# EAGLE design LM2675_imp (EAGLE 6.4)
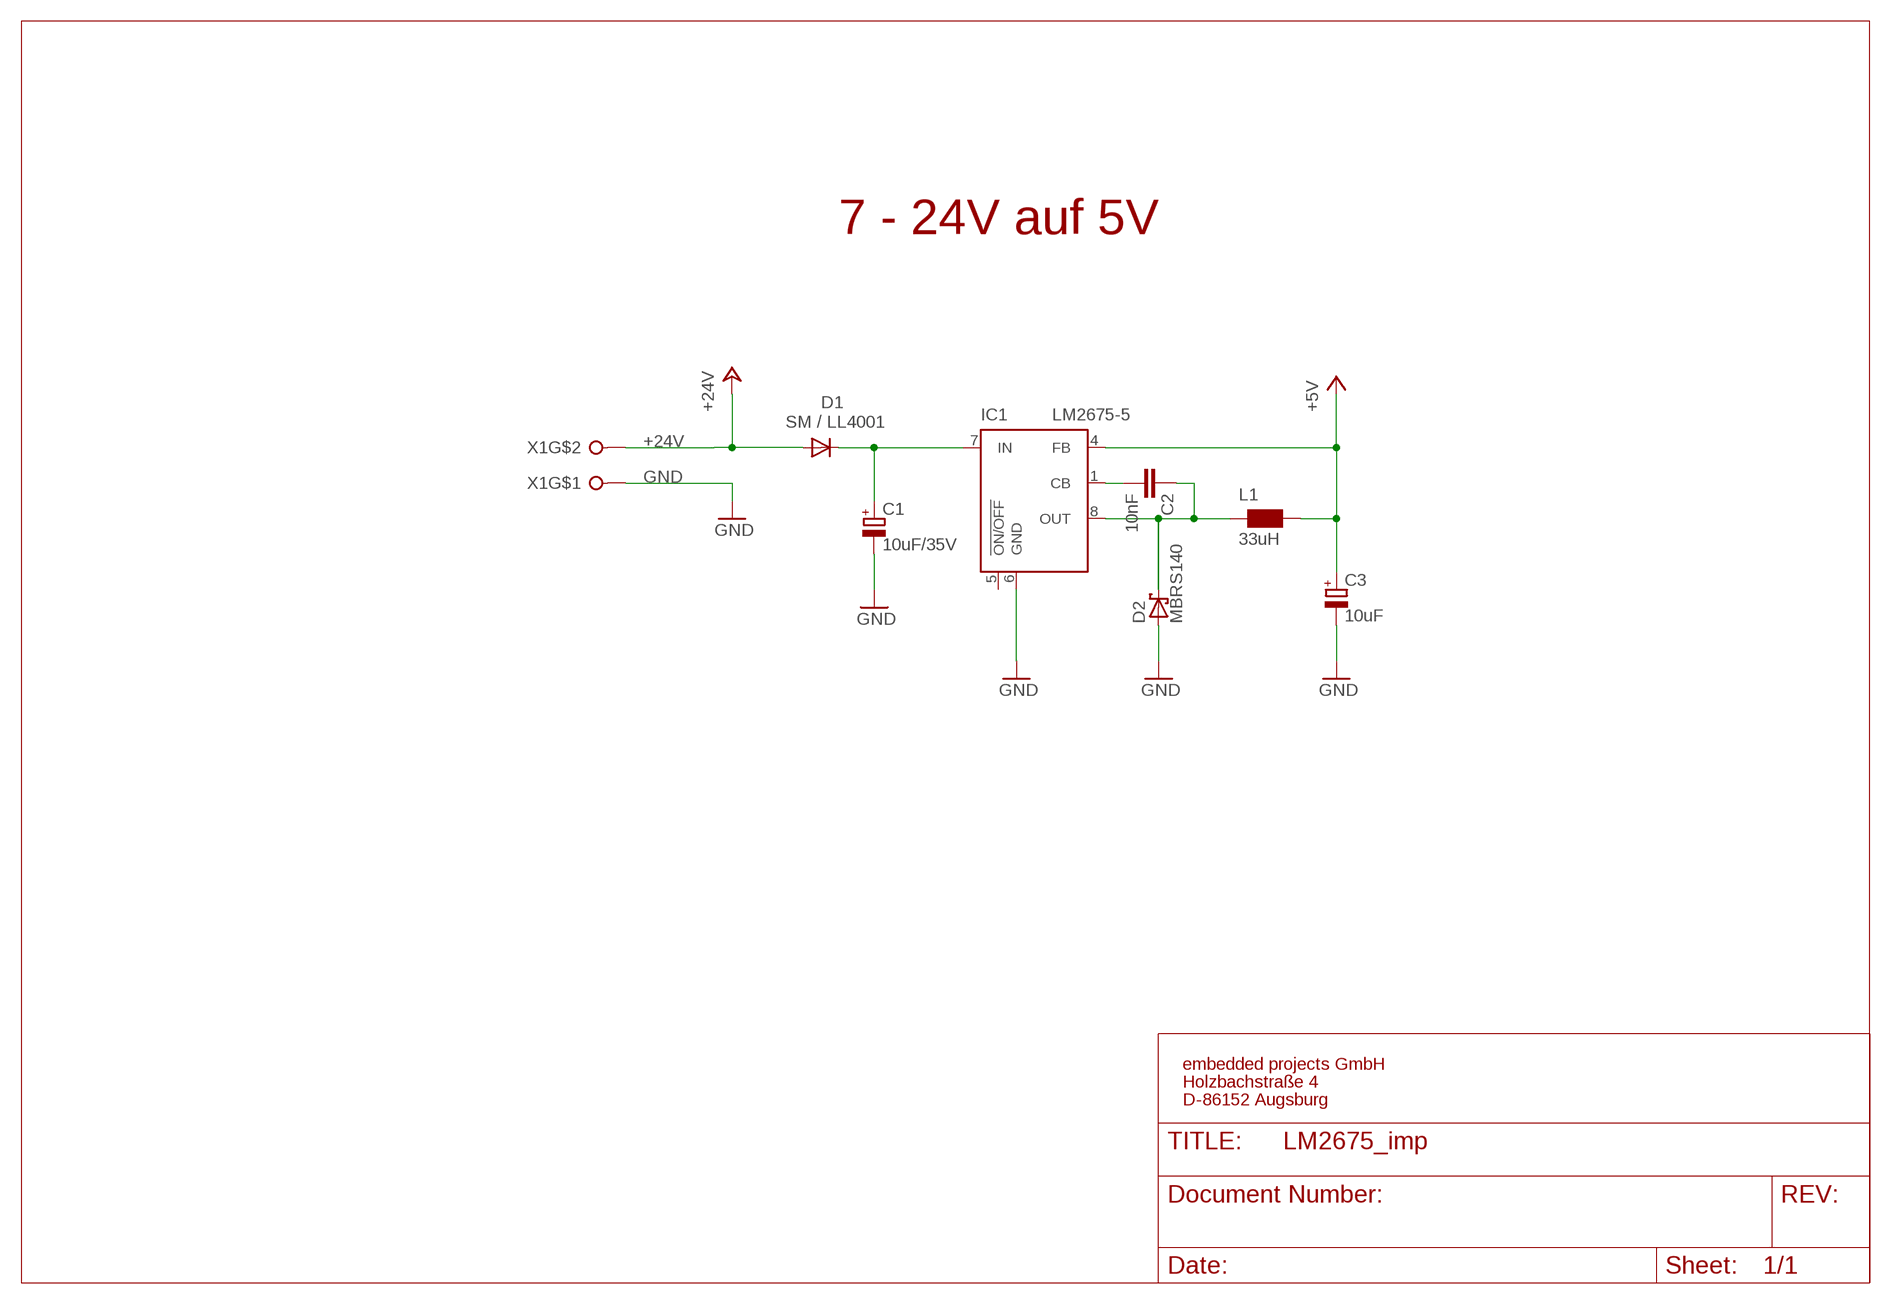
[diagram p0: schematic, sheet 1]

## Parts
C1  10uF/35V  CPOL-EUC  [PANASONIC_C]
C2  10nF  C-EUC0805  [C0805]
C3  10uF  CPOL-EUD/7343-31R  [D/7343-31R]
D1  SM / LL4001  DIODE-MINIMELF  [MINIMELF]
D2  MBRS140  MBRS130LT3  [SMB]
IC1  LM2675-5  LM2675MSO-8  [SO-8]
L1  33uH  WE-PD_S/M  [WE-PD_S/M]
X1  CON-WAGO508_W237-02  [W237-132]

## Nets
+5V: C3.+ IC1.4(FB) L1.1
+24V: D1.A X1.2
GND: C1.- C3.- D2.A IC1.6(GND) X1.1
N$40: C1.+ D1.C IC1.7(IN)
N$59: C2.2 IC1.1(CB)
OUT: C2.1 D2.C IC1.8(OUT) L1.2
Unconnected: IC1.5(!ON/OFF)

## Notes on the sheet
- 7 - 24V auf 5V
- embedded projects GmbH
- Holzbachstraße 4
- D-86152 Augsburg

## Library data of the parts
C1 = rcl:CPOL-EU: POLARIZED CAPACITOR, European symbol; EP: 400118; FARNELL: 9697012
C2 = rcl:C-EU: CAPACITOR, European symbol
C3 = rcl:CPOL-EU: POLARIZED CAPACITOR, European symbol
D1 = diode:DIODE-: DIODE; FARNELL: 7355521; POLLIN: 140697
D2 = diode:MBRS130LT3: Schottky Power Rectifier Source: http://www.onsemi.com/pub/Collateral/MBRS130LT3-D.PDF; EP: 400020
IC1 = LM2675M:LM2675M; EP: 400974; FARNELL: 9489746
L1 = Wurth_Electronics_Midcom_Speedy_and_standard_magnetics:WE-PD: SMD-Shielded Power Inductors WE-PD Is recommended for the application with switching regulators with low operating voltages (computer, laptop, mobile phones, pagers) - Magnetically shielded version which results in a low leakage field - High storage capacity - Low self-losses -- Integrated DC/DC-converter Website: Wurth Electronics <http://www.we-online.com> Contact us Wurth Electronics Midcom, Inc. 121 Airport Dr. Watertown, SD 57201 Phone: (605) 886-4385 Fax: (605) 886-4486 E-Mail: midcom@we-online.com; EP: 400973; FARNELL: 744778133
X1 = EmbeddedProjectsBauteile:CON-WAGO508_W237-02: WAGO SREW CLAMP

## Net classes
0 default: width 0.2 mm, drill 0.3 mm, clearance 0.2 mm
1 500mA: width 0.3 mm, drill 0.3 mm, clearance 0.15 mm
2 5V: width 0.4 mm

## Board
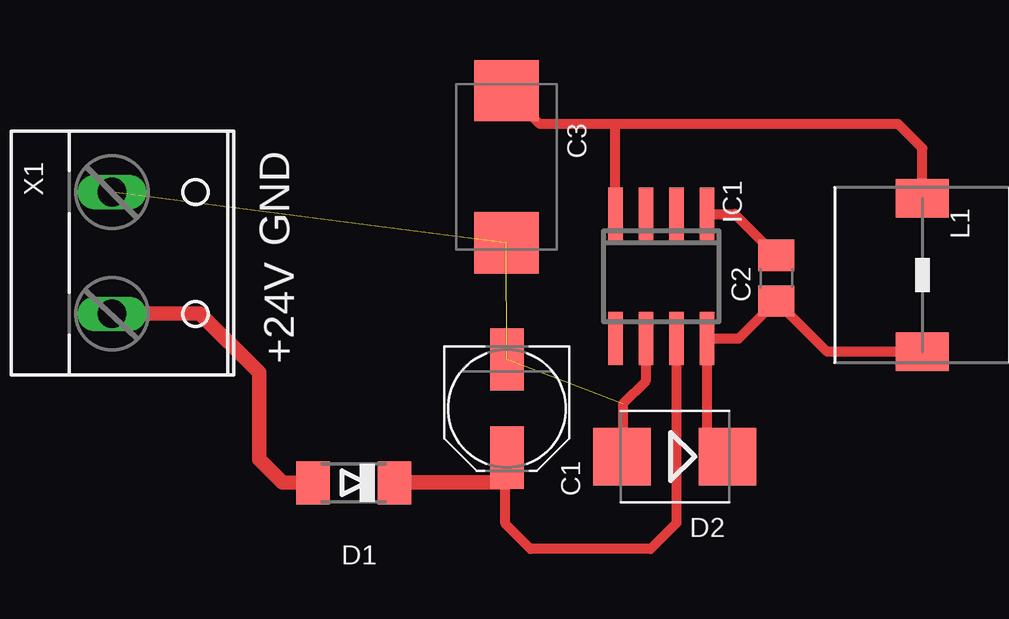
[diagram p1: board, top side]

No outline drawn. Coordinates in mm, seen from the top.
Copper layers (1*16): Top 0.012mm / dielectric 0.36mm / Bottom 0.012mm
Design rules "125um_0.2mmborhung_4Layer *": minimum track width 0.125mm, minimum drill 0.25mm, track to track 0.125mm, track to pad 0.125mm, pad to pad 0.125mm, via to via 0.125mm, smd to smd 0mil, copper to edge 0.4mm, drill to drill 0.3mm, minimum pad ring 0.125mm, minimum via ring 0.125mm, stop-mask expansion 0.125mm, vias tented up to drill 40mil, thermal gap 0.2mm

### Footprints (pad centres in the part's own frame; a part is rotated, then mirrored left to right if it is on the bottom)
PANASONIC_C = smd 2.6 x 1.4: + 2.05,0; - -2.05,0
C0805 = smd 1.3 x 1.5: 1 -0.95,0; 2 0.95,0
D/7343-31R = smd 2.55 x 2.7: + 3.175,0; - -3.175,0
MINIMELF = smd 1.4 x 1.8: A 1.7,0; C -1.7,0
SMB = smd 2.4 x 2.4: A 2.2,0; C -2.2,0
SO-8 = smd 0.6 x 2.2: 1 -1.905,-2.6; 2 -0.635,-2.6; 3 0.635,-2.6; 4 1.905,-2.6; 5 1.905,2.6; 6 0.635,2.6; 7 -0.635,2.6; 8 -1.905,2.6
WE-PD_S/M = smd 1.6 x 2.2: 1 -3.2,0; 2 3.2,0
W237-132 = drill 1.194 long: 1 -2.54,-0.635; 2 2.54,-0.635

### Placement (x,y rotation side)
C1  26.35,14.07 270 top
C2  37.58,19.51 90 top
C3  26.33,24.16 90 top
D1  19.97,10.98 180 top
D2  33.35,12.07 180 top
IC1  32.78,19.59 180 top
L1  43.66,19.64 270 top
X1  10.53,20.56 270 top

### Tracks (layer width: path | path; a pad name or v marks a point on that pad's centre or on a via)
+5V
  Top 0.406: L1.1 43.66,24.93 42.65,25.94 30.78,25.94 | 30.78,25.94 27.73,25.94 C3.+ | IC1.4 30.88,25.84 30.78,25.94
+24V
  Top 0.406: 9.9,18.03 X1.2
  Top 0.61: 9.9,18.03 12.97,18.03 13.56,18.03 16.03,15.57 16.03,11.96 17,11 D1.A
GND  (3 unrouted)
  Top 0.406: IC1.6 32.13,15.21 31.18,14.27 31.18,14.1 D2.A
N$40
  Top 0.254: 21.64,11.16 22.08,11
  Top 0.406: IC1.7 33.41,9.29 32.34,8.22 27.33,8.22 26.29,9.27 26.29,11.02 C1.+
  Top 0.61: D1.C 22.08,11 26.29,11 C1.+
N$59
  Top 0.406: IC1.1 35.85,22.19 C2.2
OUT
  Top 0.406: D2.C 34.69,13.15 IC1.8 36.01,16.99 C2.1 39.7,16.44 L1.2

### Text on the board
tPlace: GND | +24V